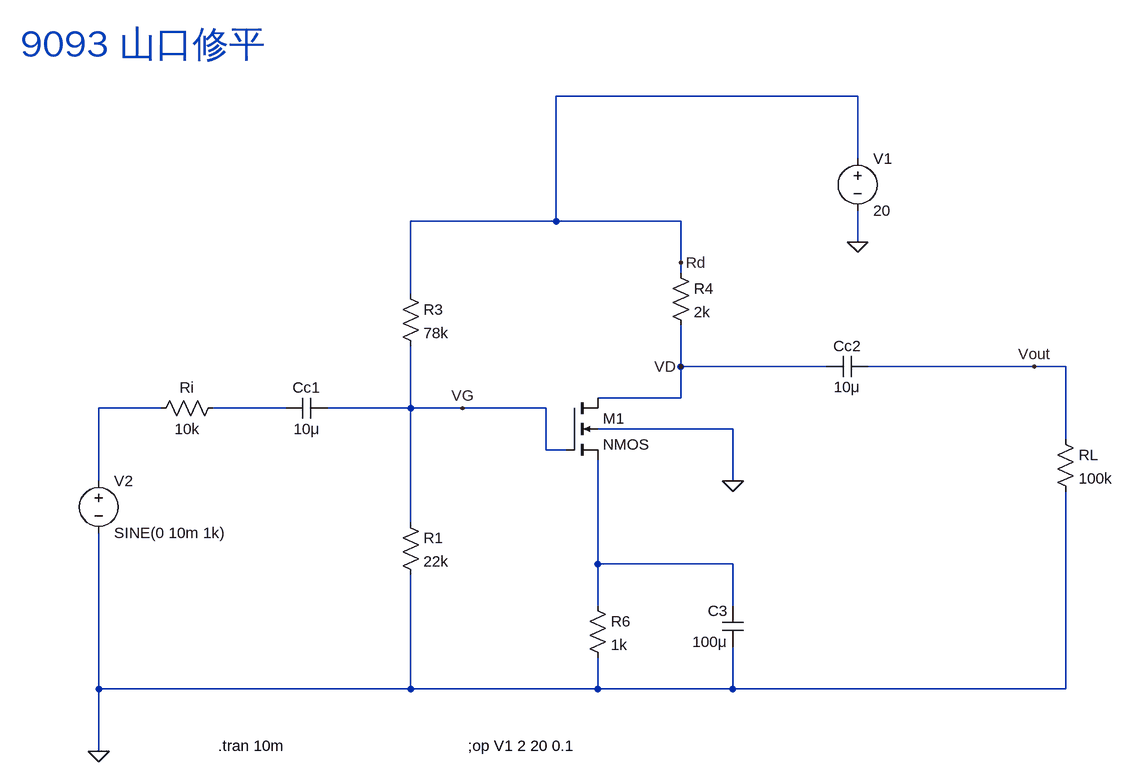
[diagram p0: schematic Draft2.asc]
Draft2.asc, the LTspice schematic file:
Version 4
SHEET 1 1664 984
WIRE 1264 -256 800 -256
WIRE 1264 -160 1264 -256
WIRE 800 -64 800 -256
WIRE 800 -64 576 -64
WIRE 992 -64 800 -64
WIRE 1264 -32 1264 -80
WIRE 992 0 992 -64
WIRE 992 16 992 0
WIRE 576 48 576 -64
WIRE 992 160 992 96
WIRE 1216 160 992 160
WIRE 1536 160 1280 160
WIRE 1584 160 1536 160
WIRE 992 208 992 160
WIRE 992 208 864 208
WIRE 192 224 96 224
WIRE 384 224 272 224
WIRE 576 224 576 128
WIRE 576 224 448 224
WIRE 656 224 576 224
WIRE 784 224 656 224
WIRE 1072 256 864 256
WIRE 1584 272 1584 160
WIRE 784 288 784 224
WIRE 816 288 784 288
WIRE 96 336 96 224
WIRE 1072 336 1072 256
WIRE 576 400 576 224
WIRE 864 464 864 304
WIRE 1072 464 864 464
WIRE 864 528 864 464
WIRE 1072 528 1072 464
WIRE 96 656 96 416
WIRE 576 656 576 480
WIRE 576 656 96 656
WIRE 864 656 864 608
WIRE 864 656 576 656
WIRE 1072 656 1072 592
WIRE 1072 656 864 656
WIRE 1584 656 1584 352
WIRE 1584 656 1072 656
WIRE 96 752 96 656
FLAG 1264 -32 0
FLAG 1072 336 0
FLAG 96 752 0
FLAG 1536 160 Vout
FLAG 992 160 VD
FLAG 656 224 VG
FLAG 992 0 Rd
SYMBOL voltage 96 320 R0
SYMATTR InstName V2
SYMATTR Value SINE(0 10m 1k)
SYMBOL res 288 208 R90
WINDOW 0 0 56 VBottom 2
WINDOW 3 32 56 VTop 2
SYMATTR InstName Ri
SYMATTR Value 10k
SYMBOL cap 448 208 R90
WINDOW 0 0 32 VBottom 2
WINDOW 3 32 32 VTop 2
SYMATTR InstName Cc1
SYMATTR Value 10μ
SYMBOL res 560 384 R0
SYMATTR InstName R1
SYMATTR Value 22k
SYMBOL res 560 32 R0
SYMATTR InstName R3
SYMATTR Value 78k
SYMBOL res 976 0 R0
SYMATTR InstName R4
SYMATTR Value 2k
SYMBOL res 1568 256 R0
SYMATTR InstName RL
SYMATTR Value 100k
SYMBOL res 848 512 R0
SYMATTR InstName R6
SYMATTR Value 1k
SYMBOL cap 1280 144 R90
WINDOW 0 0 32 VBottom 2
WINDOW 3 32 32 VTop 2
SYMATTR InstName Cc2
SYMATTR Value 10μ
SYMBOL cap 1088 592 R180
WINDOW 0 24 56 Left 2
WINDOW 3 24 8 Left 2
SYMATTR InstName C3
SYMATTR Value 100μ
SYMBOL voltage 1264 -176 R0
SYMATTR InstName V1
SYMATTR Value 20
SYMBOL nmos4 816 208 R0
SYMATTR InstName M1
SYMATTR Value2 l=5μ w=30μ
TEXT 280 744 Left 2 !.tran 10m
TEXT 664 744 Left 2 !;op V1 2 20 0.1
TEXT -24 -336 Left 5 ;9093 山口修平

The netlist it stands for:
* Draft2.asc
V2 N001 0 SINE(0 10m 1k)
Ri N002 N001 10k
Cc1 VG N002 10μ
R1 VG 0 22k
R3 Rd VG 78k
R4 Rd VD 2k
RL Vout 0 100k
R6 N003 0 1k
Cc2 Vout VD 10μ
C3 0 N003 100μ
V1 Rd 0 20
M1 VD VG N003 0 NMOS l=5μ w=30μ
.model NMOS NMOS
.model PMOS PMOS
.lib standard.mos
.tran 10m
;op V1 2 20 0.1
* 9093 山口修平
.backanno
.end